# Altium schematic sheet ucExpandido.SchDoc: DE:TMP:11:UC:EXPANDIDO
size 144 x 99 mm; Date: 21-07-2022; SheetNumber: 1; SheetTotal: 1; WebFGR: www.abebashop.com; VersionFGR: 20220721; PageSetup: Record=PageOptions|CenterHorizontal=True|CenterVertical=True|PrintScale=1.90|XCorrection=1.00|YCorrection=1.00|PrintKind=0|BorderSize=5000000|LeftOffset=0|BottomOffset=0|Orientation=2|PaperLength=1000|PaperWidth=1000|Scale=100|PaperSource=7|PrintQuality=-4|MediaType=1|DitherType=10|PaperKind=Letter|PrintScaleMode=1
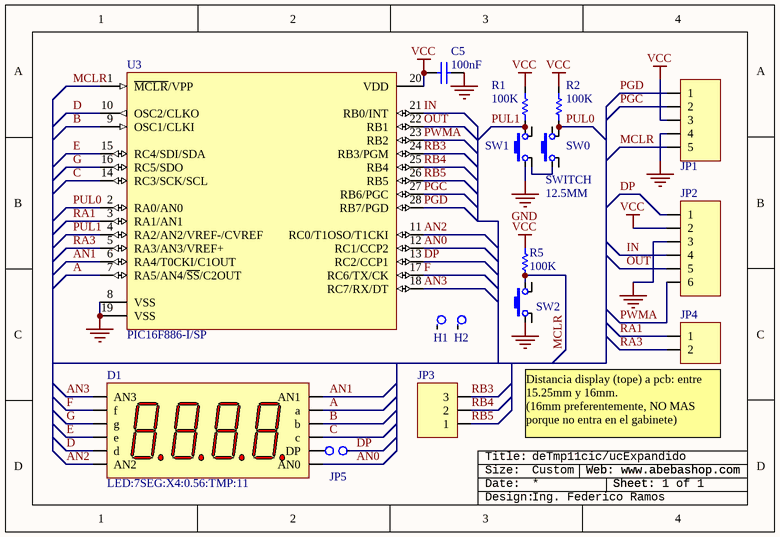
[diagram p0: ucExpandido.SchDoc]

## Parts
C5  Capacidad: 100nF  [C1206]  (hidden comment: Capacitor 1206; 100nF; 50V)
D1  LED:7SEG:X4:0.56:TMP:11  [LED:7SEG:X4:0.56]
H1  Agujero de montaje  [AGUJERO_TAMECO_30MM]  (value not drawn)
H2  Agujero de montaje  [AGUJERO_TAMECO_30MM]  (value not drawn)
JP1  Header5x1  [HDR5x1]  (value not drawn)
JP2  Header6x1  [HDR6x1]  (value not drawn)
JP3  Header3x1  [HDR3x1]  (value not drawn)
JP4  Header2x1  [HDR2x1]  (value not drawn)
JP5  Jumper 2 contactos; Soldadura  [JUMPER2]  (value not drawn)
R1  Resistencia: 100K  [R1206]  (hidden comment: Resistencia 1206; 100Kohm)
R2  Resistencia: 100K  [R1206]  (hidden comment: Resistencia 1206; 100Kohm)
R5  Resistencia: 100K  [RES300th]  (hidden comment: Resistencia 1206; 10Kohm)
ROT?  Rotulo  (value not drawn)  (graphical)
SW0  SWITCH  Price: 12.5MM  [SW_T_5MM]
SW1  SW_T_5MM  [SW_T_5MM]  (value not drawn)
SW2  SW_T_5MM  [SW_T_5MM]  (value not drawn)
U3  PIC16F886-I/SP  [soic28]

## Nets
GND: C5.2 JP1.4 JP2.3 SW1.4 SW2.4 U3.8(VSS) U3.19(VSS)
VCC: C5.1 JP1.3 JP2.2 R1.2 R2.2 R5.2 U3.20(VDD)
A: D1.11(a) U3.7(RA5/AN4/~{SS}/C2OUT)
AN0: D1.7(AN0) U3.12(RC1/CCP2)
AN1: D1.12(AN1) U3.6(RA4/T0CKI/C1OUT)
AN2: D1.6(AN2) U3.11(RC0/T1OSO/T1CKI)
AN3: D1.1(AN3) U3.18(RC7/RX/DT)
B: D1.10(b) U3.9(OSC1/CLKI)
C: D1.9(c) U3.14(RC3/SCK/SCL)
D: D1.5(d) U3.10(OSC2/CLKO)
DP: JP2.1 JP5.2 U3.13(RC2/CCP1)
E: D1.4(e) U3.15(RC4/SDI/SDA)
F: D1.2(f) U3.17(RC6/TX/CK)
G: D1.3(g) U3.16(RC5/SDO)
IN: JP2.4 U3.21(RB0/INT)
MCLR: JP1.5 R5.1 SW2.3 U3.1(~{MCLR}/VPP)
OUT: JP2.5 U3.22(RB1)
PGC: JP1.2 U3.27(RB6/PGC)
PGD: JP1.1 U3.28(RB7/PGD)
PUL0: R2.1 SW0.1 U3.2(RA0/AN0)
PUL1: R1.1 SW1.3 U3.4(RA2/AN2/VREF-/CVREF)
PWMA: JP2.6 U3.23(RB2)
RA1: JP4.1 U3.3(RA1/AN1)
RA3: JP4.2 U3.5(RA3/AN3/VREF+)
RB3: JP3.3 U3.24(RB3/PGM)
RB4: JP3.2 U3.25(RB4)
RB5: JP3.1 U3.26(RB5)
NetD1_8: D1.8(DP) JP5.1
NetSW0_4: SW0.4 SW1.2

Not connected (* = marked no-connect by the designer): H1 1; H2 1; SW0 2 3; SW1 1; SW2 1 2

## Notes on the sheet
- Posible reemplazo (mejora) vs 16F886 (8 level stack / 8K flash / 368 ram)
  Mouser: PIC16F18056-I/SO (>4x RAM 2x Stack) Muy barato.
  Elemon: PIC16F1847T-I/SO (2x RAM & 2x Stack)
  10PCS PIC16F1788-I/SO 8-Bit Flash PIC Chip (???)
  Elemon PIC16F1936-I/SO (16 level stack / 8K flash / 512 ram) Mejora stack pero misma rom
  Elemon PIC16F18855 (16 level stack / 8K flash / 1K ram) 2x stack, = rom
  Elemon PIC16F18856 (16 level stack / 16K flash / 2K ram) 2x stack, 2x rom, 3x ram
  Elemon PIC16F18857 (16 level stack / 32K flash / 4K ram) 2x stack, 4x rom, 6x ram
  18F2550 (31 level stacl / 32K flash / 2K ram)
- (near JP3) PGD/PGC son un conector 2x1 largo para poder conectar a la placa "main" y al mismo tiempo al programador.
- (near JP4) Distancia display (tope) a pcb: entre 15.25mm y 16mm.
  (16mm preferentemente, NO MAS porque no entra en el gabinete)
- deTmp11cic/ucExpandido
- Custom
- (near ROT?) Web: www.abebashop.com
- Sheet: 1 of 1
- Ing. Federico Ramos
- (in symbol Rotulo) Title:; Size:; Web: www.abebashop.com; Date:; Sheet:; Design:

## Library data of the parts
C5 = Capacitor 1206; 100nF; 50V: Dolares Elemon: 0.03125; Codigo Elemon: CA3269770K; Voltaje: 50V
JP1 = Header5x1: Header 5x1; Price: ?
JP2 = Header6x1: Header 6x1; Price: ?
JP3 = Header3x1: Header 3x1; Price: ?
JP4 = Header2x1: Header 2x1; Price: ?
R1 R2 = Resistencia 1206; 100Kohm: Codigo Elemon: RS3886305; Dolares Elemon: 0.00719
R5 = Resistencia 1206; 10Kohm: Codigo Elemon: RS3886245; Dolares Elemon: 0.00718
ROT? = Rotulo: Rotulo [consolas]
SW0 = SW_T_5MM
U3 = PIC16F883-I/SP: Codigo Elemon: MI2986410; Dolares Elemon: 3.21801
SW1 SW2 = SW_T_5MM: Price: ?